# Altium schematic sheet P10_USB TO UART0_IO EXP_ADC.SchDoc
size 420 x 297 mm
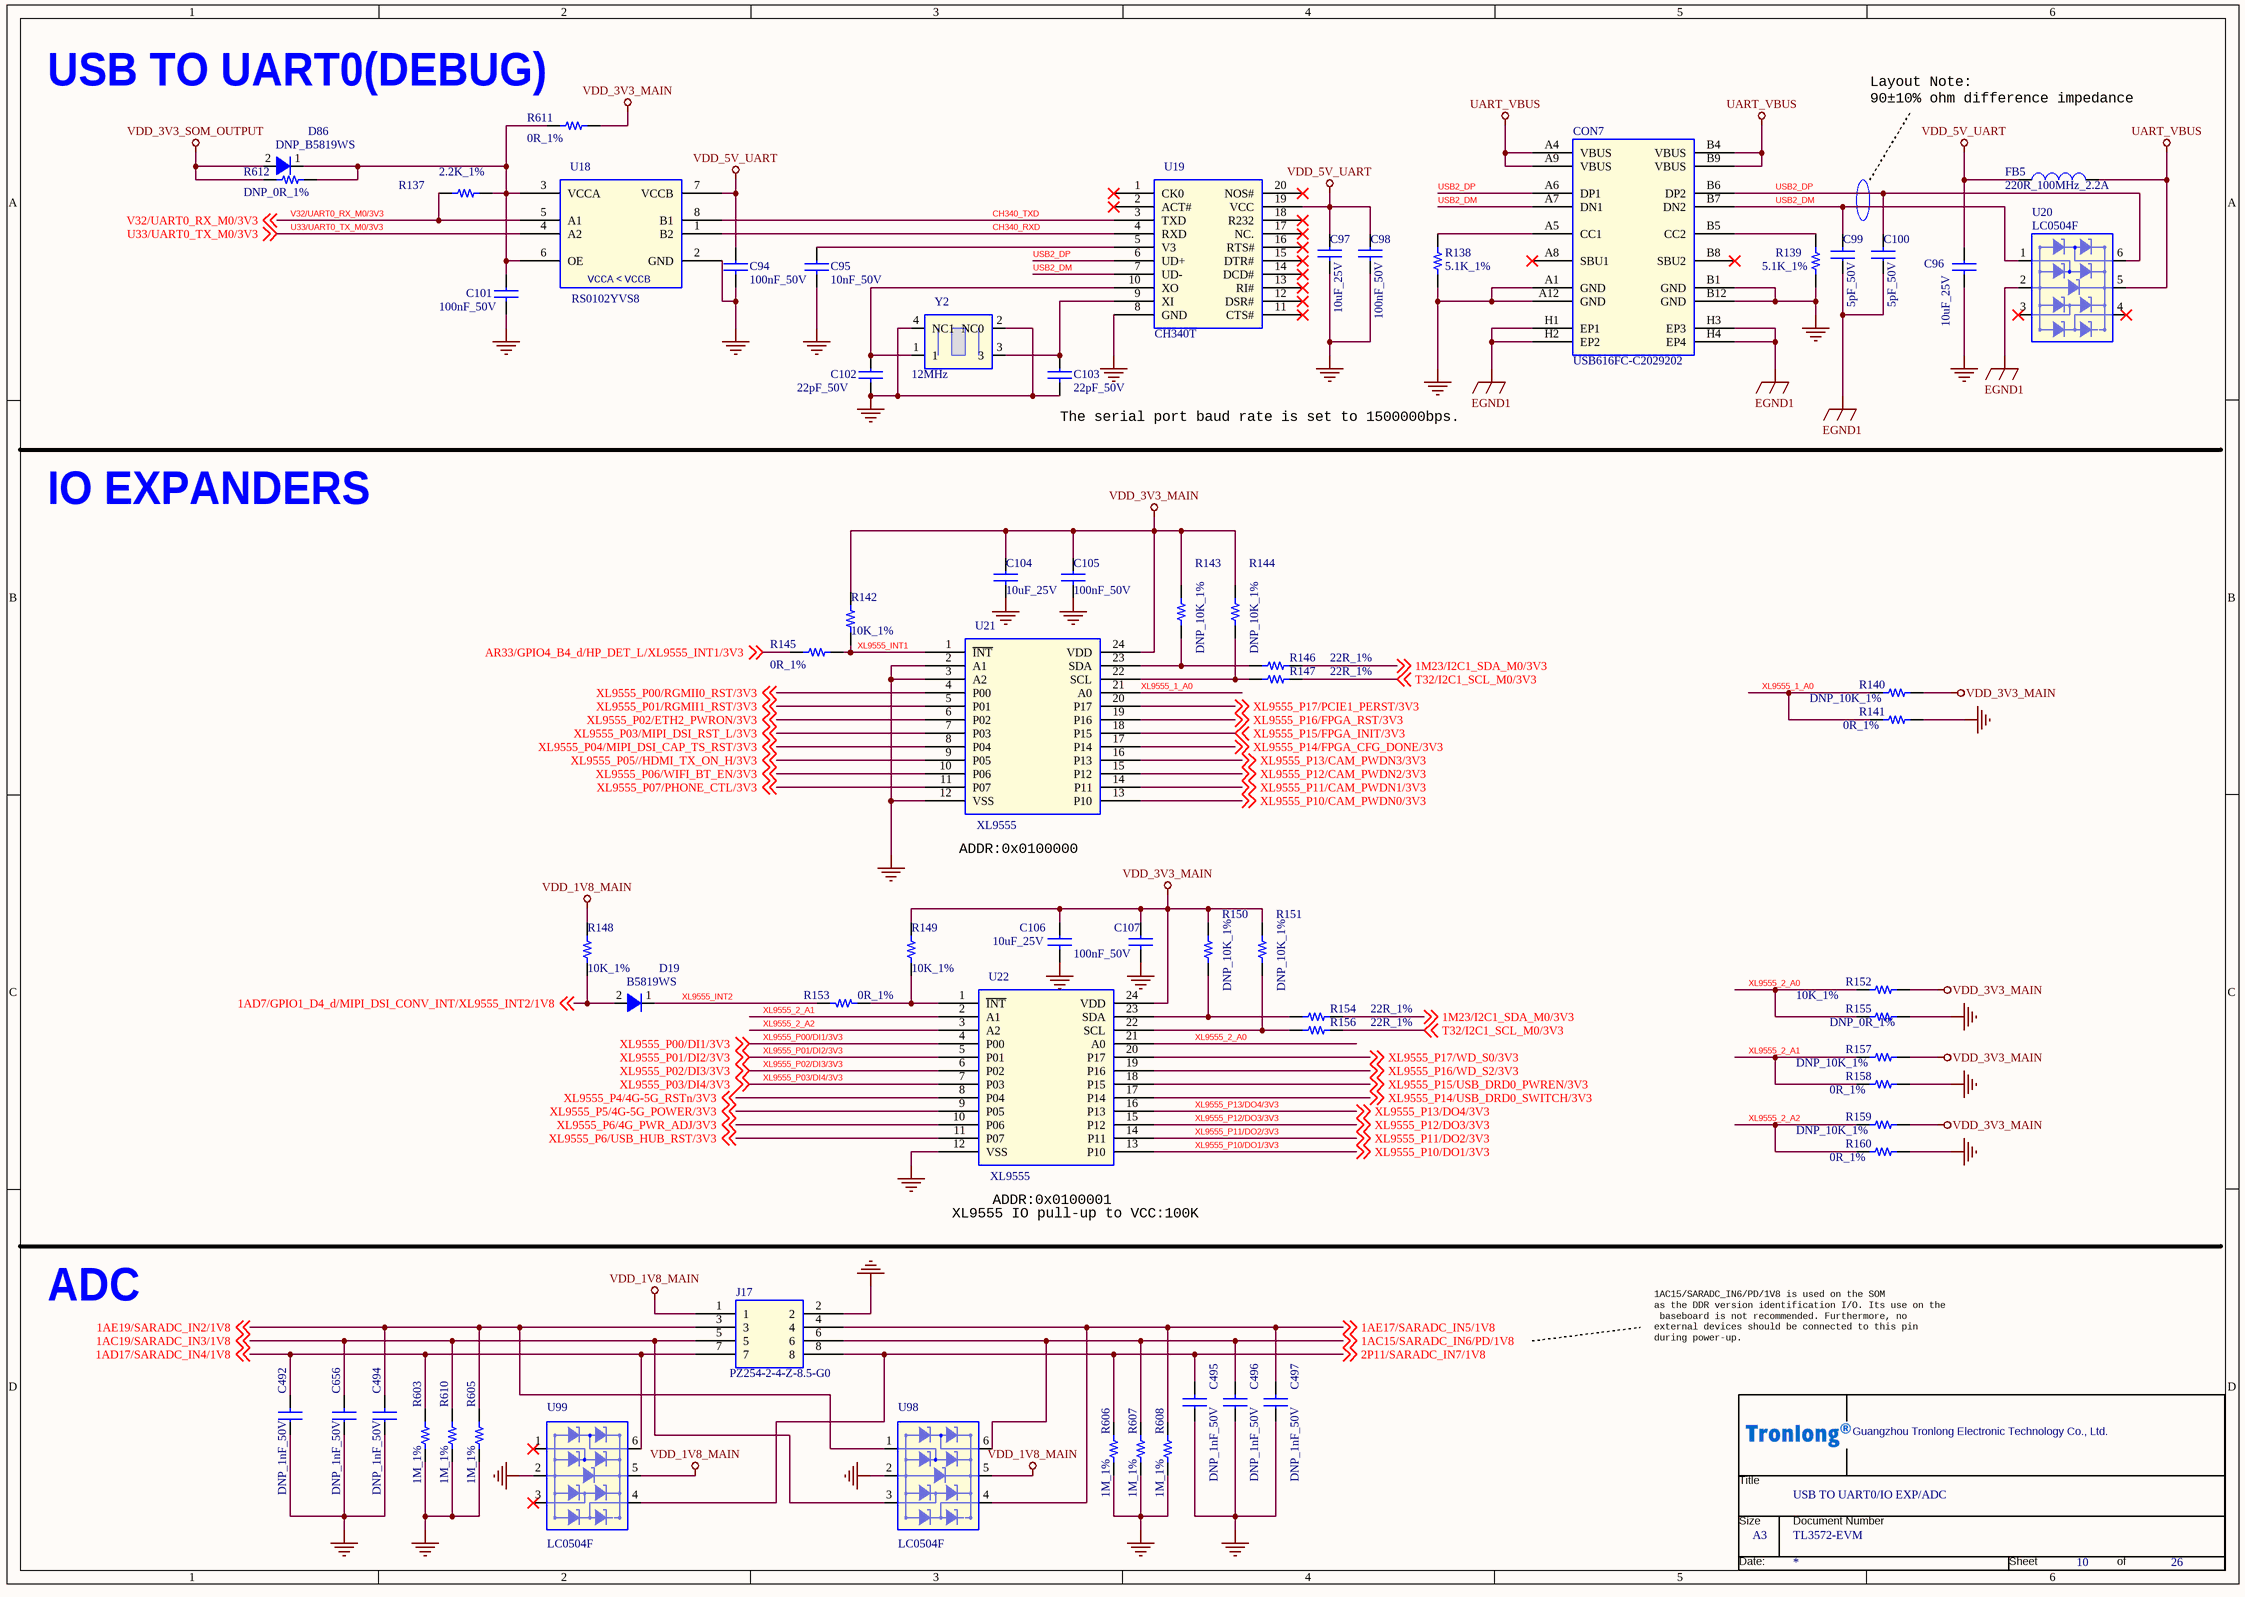
[diagram p0: P10_USB TO UART0_IO EXP_ADC.SchDoc]

## Parts
*  Doc: TL3572-EVM  Title: USB TO UART0/IO EXP/ADC  OrgName: Guangzhou Tronlong Electronic Technology Co., Ltd.  Page Size: A3  Page Number: 10  Page Count: 26  (hidden comment: Tronlong_TITTLE_20211115)  (graphical)
C94  100nF_50V  [C0402]
C95  10nF_50V  [C0402]
C96  10uF_25V  [C0603]
C97  10uF_25V  [C0603]
C98  100nF_50V  [C0402]
C99  5pF_50V  [C0402]
C100  5pF_50V  [C0402]
C101  100nF_50V  [C0402]
C102  22pF_50V  [C0603]
C103  22pF_50V  [C0603]
C104  10uF_25V  [C0603]
C105  100nF_50V  [C0402]
C106  10uF_25V  [C0603]
C107  100nF_50V  [C0402]
C492  DNP_1nF_50V  [C0402]
C494  DNP_1nF_50V  [C0402]
C495  DNP_1nF_50V  [C0402]
C496  DNP_1nF_50V  [C0402]
C497  DNP_1nF_50V  [C0402]
C656  DNP_1nF_50V  [C0402]
CON7  USB616FC-C2029202  [TYPE-C_16P_180_SMD]
D19  B5819WS  [SOD-323]
D86  DNP_B5819WS  [SOD-323]
FB5  220R_100MHz_2.2A  [L0603]
J17  PZ254-2-4-Z-8.5-G0  [CON_2D54_2X4_TH]
R137  2.2K_1%  [R0603]
R138  5.1K_1%  [R0603]
R139  5.1K_1%  [R0603]
R140  DNP_10K_1%  [R0402]
R141  0R_1%  [R0603]
R142  10K_1%  [R0402]
R143  DNP_10K_1%  [R0402]
R144  DNP_10K_1%  [R0402]
R145  0R_1%  [R0402]
R146  22R_1%  [R0402]
R147  22R_1%  [R0402]
R148  10K_1%  [R0402]
R149  10K_1%  [R0402]
R150  DNP_10K_1%  [R0402]
R151  DNP_10K_1%  [R0402]
R152  10K_1%  [R0402]
R153  0R_1%  [R0402]
R154  22R_1%  [R0402]
R155  DNP_0R_1%  [R0402]
R156  22R_1%  [R0402]
R157  DNP_10K_1%  [R0402]
R158  0R_1%  [R0402]
R159  DNP_10K_1%  [R0402]
R160  0R_1%  [R0402]
R603  1M_1%  [R0603]
R605  1M_1%  [R0603]
R606  1M_1%  [R0603]
R607  1M_1%  [R0603]
R608  1M_1%  [R0603]
R610  1M_1%  [R0603]
R611  0R_1%  [R0402]
R612  DNP_0R_1%  [R0402]
U18  RS0102YVS8  [SOP8-20-91]
U19  CH340T  [TSSOP-20]
U20  LC0504F  [SOT363]
U21  XL9555  [TSSOP24]
U22  XL9555  [TSSOP24]
U98  LC0504F  [SOT363]
U99  LC0504F  [SOT363]
Y2  12MHz  [SMD_3225]

## Nets
EGND1: C99.1 C100.1 CON7.H1(EP1) CON7.H2(EP2) CON7.H3(EP3) CON7.H4(EP4) U20.2
GND: C94.2 C95.2 C96.2 C97.2 C98.2 C101.2 C102.2 C103.2 C104.2 C105.2 C106.2 C107.2 C492.1 C494.1 C495.1 C496.1 C497.1 C656.1 CON7.A1(GND) CON7.A12(GND) CON7.B1(GND) CON7.B12(GND) J17.2 R138.2 R139.2 R141.2 R155.2 R158.2 R160.2 R603.2 R605.2 R606.2 R607.2 R608.2 R610.2 U18.2(GND) U19.8(GND) U21.2(A1) U21.3(A2) U21.12(VSS) U22.12(VSS) U98.2 U99.2 Y2.2(NC0) Y2.4(NC1)
UART_VBUS: CON7.A4(VBUS) CON7.A9(VBUS) CON7.B4(VBUS) CON7.B9(VBUS) FB5.2 U20.5
VDD_1V8_MAIN: J17.1 R148.1 U98.5 U99.5
VDD_3V3_MAIN: C104.1 C105.1 C106.1 C107.1 R140.1 R142.1 R143.1 R144.1 R149.1 R150.1 R151.1 R152.1 R157.1 R159.1 R611.2 U21.24(VDD) U22.24(VDD)
VDD_3V3_SOM_OUTPUT: D86.2(Cathode) R612.1
VDD_5V_UART: C94.1 C96.1 C97.1 C98.1 FB5.1 U18.7(VCCB) U19.19(VCC)
1AC15/SARADC_IN6/PD/1V8: C496.2 J17.6 R607.1 U98.6 ; off-sheet 1AC15/SARADC_IN6/PD/1V8
1AC19/SARADC_IN3/1V8: C656.2 J17.5 R610.1 U98.3 ; off-sheet 1AC19/SARADC_IN3/1V8
1AD7/GPIO1_D4_d/MIPI_DSI_CONV_INT/XL9555_INT2/1V8: D19.2(Cathode) R148.2 ; off-sheet 1AD7/GPIO1_D4_d/MIPI_DSI_CONV_INT/XL9555_INT2/1V8
1AD17/SARADC_IN4/1V8: C492.2 J17.7 R603.1 U99.6 ; off-sheet 1AD17/SARADC_IN4/1V8
1AE17/SARADC_IN5/1V8: C497.2 J17.4 R608.1 U98.4 ; off-sheet 1AE17/SARADC_IN5/1V8
1AE19/SARADC_IN2/1V8: C494.2 J17.3 R605.1 U98.1 ; off-sheet 1AE19/SARADC_IN2/1V8
1M23/I2C1_SDA_M0/3V3: R146.1 R154.1 ; off-sheet 1M23/I2C1_SDA_M0/3V3
2P11/SARADC_IN7/1V8: C495.2 J17.8 R606.1 U99.4 ; off-sheet 2P11/SARADC_IN7/1V8
AR33/GPIO4_B4_d/HP_DET_L/XL9555_INT1/3V3: R145.1 ; off-sheet AR33/GPIO4_B4_d/HP_DET_L/XL9555_INT1/3V3
CH340_RXD: U18.1(B2) U19.4(RXD)
CH340_TXD: U18.8(B1) U19.3(TXD)
T32/I2C1_SCL_M0/3V3: R147.1 R156.1 ; off-sheet T32/I2C1_SCL_M0/3V3
U33/UART0_TX_M0/3V3: U18.4(A2) ; off-sheet U33/UART0_TX_M0/3V3
USB2_DM: C99.2 CON7.A7(DN1) CON7.B7(DN2) U19.7(UD-) U20.1
USB2_DP: C100.2 CON7.A6(DP1) CON7.B6(DP2) U19.6(UD+) U20.6
V32/UART0_RX_M0/3V3: R137.1 U18.5(A1) ; off-sheet V32/UART0_RX_M0/3V3
XL9555_1_A0: R140.2 R141.1 U21.21(A0)
XL9555_2_A0: R152.2 R155.1 U22.21(A0)
XL9555_2_A1: R157.2 R158.1 U22.2(A1)
XL9555_2_A2: R159.2 R160.1 U22.3(A2)
XL9555_INT1: R142.2 R145.2 U21.1(~{INT})
XL9555_INT2: D19.1(Anode) R153.1
XL9555_P00/DI1/3V3: U22.4(P00) ; off-sheet XL9555_P00/DI1/3V3
XL9555_P00/RGMII0_RST/3V3: U21.4(P00) ; off-sheet XL9555_P00/RGMII0_RST/3V3
XL9555_P01/DI2/3V3: U22.5(P01) ; off-sheet XL9555_P01/DI2/3V3
XL9555_P01/RGMII1_RST/3V3: U21.5(P01) ; off-sheet XL9555_P01/RGMII1_RST/3V3
XL9555_P02/DI3/3V3: U22.6(P02) ; off-sheet XL9555_P02/DI3/3V3
XL9555_P02/ETH2_PWRON/3V3: U21.6(P02) ; off-sheet XL9555_P02/ETH2_PWRON/3V3
XL9555_P03/DI4/3V3: U22.7(P03) ; off-sheet XL9555_P03/DI4/3V3
XL9555_P03/MIPI_DSI_RST_L/3V3: U21.7(P03) ; off-sheet XL9555_P03/MIPI_DSI_RST_L/3V3
XL9555_P4/4G-5G_RSTn/3V3: U22.8(P04) ; off-sheet XL9555_P4/4G-5G_RSTn/3V3
XL9555_P04/MIPI_DSI_CAP_TS_RST/3V3: U21.8(P04) ; off-sheet XL9555_P04/MIPI_DSI_CAP_TS_RST/3V3
XL9555_P5/4G-5G_POWER/3V3: U22.9(P05) ; off-sheet XL9555_P5/4G-5G_POWER/3V3
XL9555_P05//HDMI_TX_ON_H/3V3: U21.9(P05) ; off-sheet XL9555_P05//HDMI_TX_ON_H/3V3
XL9555_P6/4G_PWR_ADJ/3V3: U22.10(P06) ; off-sheet XL9555_P6/4G_PWR_ADJ/3V3
XL9555_P6/USB_HUB_RST/3V3: U22.11(P07) ; off-sheet XL9555_P6/USB_HUB_RST/3V3
XL9555_P06/WIFI_BT_EN/3V3: U21.10(P06) ; off-sheet XL9555_P06/WIFI_BT_EN/3V3
XL9555_P07/PHONE_CTL/3V3: U21.11(P07) ; off-sheet XL9555_P07/PHONE_CTL/3V3
XL9555_P10/CAM_PWDN0/3V3: U21.13(P10) ; off-sheet XL9555_P10/CAM_PWDN0/3V3
XL9555_P10/DO1/3V3: U22.13(P10) ; off-sheet XL9555_P10/DO1/3V3
XL9555_P11/CAM_PWDN1/3V3: U21.14(P11) ; off-sheet XL9555_P11/CAM_PWDN1/3V3
XL9555_P11/DO2/3V3: U22.14(P11) ; off-sheet XL9555_P11/DO2/3V3
XL9555_P12/CAM_PWDN2/3V3: U21.15(P12) ; off-sheet XL9555_P12/CAM_PWDN2/3V3
XL9555_P12/DO3/3V3: U22.15(P12) ; off-sheet XL9555_P12/DO3/3V3
XL9555_P13/CAM_PWDN3/3V3: U21.16(P13) ; off-sheet XL9555_P13/CAM_PWDN3/3V3
XL9555_P13/DO4/3V3: U22.16(P13) ; off-sheet XL9555_P13/DO4/3V3
XL9555_P14/FPGA_CFG_DONE/3V3: U21.17(P14) ; off-sheet XL9555_P14/FPGA_CFG_DONE/3V3
XL9555_P14/USB_DRD0_SWITCH/3V3: U22.17(P14) ; off-sheet XL9555_P14/USB_DRD0_SWITCH/3V3
XL9555_P15/FPGA_INIT/3V3: U21.18(P15) ; off-sheet XL9555_P15/FPGA_INIT/3V3
XL9555_P15/USB_DRD0_PWREN/3V3: U22.18(P15) ; off-sheet XL9555_P15/USB_DRD0_PWREN/3V3
XL9555_P16/FPGA_RST/3V3: U21.19(P16) ; off-sheet XL9555_P16/FPGA_RST/3V3
XL9555_P16/WD_S2/3V3: U22.19(P16) ; off-sheet XL9555_P16/WD_S2/3V3
XL9555_P17/PCIE1_PERST/3V3: U21.20(P17) ; off-sheet XL9555_P17/PCIE1_PERST/3V3
XL9555_P17/WD_S0/3V3: U22.20(P17) ; off-sheet XL9555_P17/WD_S0/3V3
NetC95_1: C95.1 U19.5(V3)
NetC101_1: C101.1 D86.1(Anode) R137.2 R611.1 R612.2 U18.3(VCCA) U18.6(OE)
NetC102_1: C102.1 U19.10(XO) Y2.1
NetC103_1: C103.1 U19.9(XI) Y2.3
NetCON7_A5: CON7.A5(CC1) R138.1
NetCON7_B5: CON7.B5(CC2) R139.1
NetR143_2: R143.2 R146.2 U21.23(SDA)
NetR144_2: R144.2 R147.2 U21.22(SCL)
NetR149_2: R149.2 R153.2 U22.1(~{INT})
NetR150_2: R150.2 R154.2 U22.23(SDA)
NetR151_2: R151.2 R156.2 U22.22(SCL)

Not connected (* = marked no-connect by the designer): CON7 A8(SBU1)* B8(SBU2)*; U19 1(CK0)* 2(ACT#)* 11(CTS#)* 12(DSR#)* 13(RI#)* 14(DCD#)* 15(DTR#)* 16(RTS#)* 17(NC.)* 18(R232)* 20(NOS#)*; U20 3* 4*; U99 1* 3*

## Notes on the sheet
- USB TO UART0(DEBUG)
- Layout Note:
  90±10% ohm difference impedance
- (near C103) The serial port baud rate is set to 1500000bps.
- IO EXPANDERS
- (near U21) ADDR:0x0100000
- (near U22) ADDR:0x0100001
- XL9555 IO pull-up to VCC:100K
- ADC
- (near *) 1AC15/SARADC_IN6/PD/1V8 is used on the SOM
  as the DDR version identification I/O. Its use on the
  baseboard is not recommended. Furthermore, no
  external devices should be connected to this pin
  during power-up.
- (in symbol Tronlong_TITTLE_20211115) Title; Size; Document Number; Date:; Sheet; of
- (in symbol TXS0102DCUR_0) VCCA＜VCCB

## Library data of the parts
* = Tronlong_TITTLE_20211115: RevCode: A?; Page Create Date: March  8, 1995; Page Modify Date: *
C94 = CAP NP_Dup3: 贴片陶瓷电容,100nF,10%,50V,X7R; Manufacturer PartNumber: 0402B104K500NT; Manufacturer: 广东风华高新科技股份有限公司（FH）; Manufacturer Character: 中国大陆; Eco-Label: ROHS; Operation Temperature（℃）: -55~+125(Ta); ERP Number: 005.0001.0001.00681; As-Welded: /; PCB Footprint: C0402; Temperature: -55~155℃; Part Status: 试用
C95 = CAP NP_Dup3: 贴片陶瓷电容,10nF,10%,50V,X7R; Manufacturer Character: 中国大陆; Manufacturer PartNumber: 0402B103K500NT; Manufacturer: 广东风华高新科技股份有限公司（FH）; Eco-Label: ROHS; ERP Number: 005.0001.0001.00522; As-Welded: /; Operation Temperature（℃）: -55~+125(Ta); PCB Footprint: C0402; Part Status: 优选; Temperature: -55~155℃
C96 = CAP NP_Dup3: 贴片陶瓷电容,10uF,20%,25V,X5R; Manufacturer Character: 中国大陆; Manufacturer PartNumber: 0603X106M250NT; Manufacturer: 广东风华高新科技股份有限公司（FH）; Eco-Label: ROHS; ERP Number: 005.0001.0001.00527; As-Welded: /; room: usbuart; Operation Temperature（℃）: -55~+85(Ta); PCB Footprint: C0603; Part Status: 优选; Temperature: -55~155℃
C97 = CAP NP_Dup3: 贴片陶瓷电容,10uF,20%,25V,X5R; Manufacturer: 广东风华高新科技股份有限公司（FH）; Manufacturer PartNumber: 0603X106M250NT; Manufacturer Character: 中国大陆; Operation Temperature（℃）: -55~+85(Ta); As-Welded: /; ERP Number: 005.0001.0001.00527; Eco-Label: ROHS; PCB Footprint: C0603; Temperature: -55~155℃; Part Status: 优选
C98 C101 = CAP NP_Dup3: 贴片陶瓷电容,100nF,10%,50V,X7R; Manufacturer Character: 中国大陆; Manufacturer PartNumber: 0402B104K500NT; Manufacturer: 广东风华高新科技股份有限公司（FH）; As-Welded: /; ERP Number: 005.0001.0001.00681; Operation Temperature（℃）: -55~+125(Ta); Eco-Label: ROHS; PCB Footprint: C0402; Temperature: -55~155℃; Part Status: 试用
C99 = CAP NP_1: CC0402BRNPO9BN5R0; Manufacturer: 广州创龙; Manufacturer PN: GRM033R61E102KA01; Manufacturer PartNumber: 5pF,2%,C0402,50V,（NPO）; Eco-Label: ROHS; ERP Number: 005.0001.0022.00228; RK PN: 902003109; Priority: A; Tolerance: ±10%; Operation Temperature（℃）: -40~+85(Ta); As-Welded: /; Part Type: 一般用片状陶瓷电容; Created by: JJJ; Manufacturer Character: -; Part Status: -
C100 = CAP NP_1: CC0402BRNPO9BN5R0; Manufacturer PartNumber: 5pF,2%,C0402,50V,（NPO）; Manufacturer PN: GRM033R61E102KA01; Manufacturer: 广州创龙; Eco-Label: ROHS; As-Welded: /; Operation Temperature（℃）: -40~+85(Ta); Tolerance: ±10%; Priority: A; RK PN: 902003109; ERP Number: 005.0001.0022.00228; Manufacturer Character: -; Created by: JJJ; Part Type: 一般用片状陶瓷电容; Part Status: -
C102 C103 = CAP NP_Dup3: 贴片陶瓷电容,22pF,5%,50V,COG; Manufacturer: 广东风华高新科技股份有限公司（FH）; Manufacturer PartNumber: 0603CG220J500NT; Manufacturer Character: 中国大陆; Eco-Label: EXEMPTION; ERP Number: 005.0001.0001.00542; Operation Temperature（℃）: -55~+125(Ta); As-Welded: /; PCB Footprint: C0603; Part Status: 优选; Temperature: -55~155℃
C104 = CAP NP_Dup3: 贴片陶瓷电容,4.7uF,10%,25V,X5R; Manufacturer: 广东风华高新科技股份有限公司（FH）; Manufacturer PartNumber: 0603X475K250NT; Manufacturer Character: 中国大陆; Operation Temperature（℃）: -55~+85(Ta); As-Welded: /; ERP Number: 005.0001.0001.00527; Eco-Label: ROHS; PCB Footprint: C0603; Part Status: 优选
C105 = CAP NP_Dup3: 贴片陶瓷电容,100nF,10%,50V,X7R; Manufacturer: 广东风华高新科技股份有限公司（FH）; Manufacturer PartNumber: 0402B104K500NT; Manufacturer Character: 中国大陆; Operation Temperature（℃）: -55~+125(Ta); As-Welded: /; ERP Number: 005.0001.0001.00681; Eco-Label: ROHS; PCB Footprint: C0402; Part Status: 试用
C106 = CAP NP_Dup2: 贴片陶瓷电容10uF,20%,25V,X5R; Manufacturer Character: 中国大陆; Manufacturer: 广东风华高新科技股份有限公司（FH）; Manufacturer PartNumber: 0603X106M250NT; ERP Number: 005.0001.0001.00527; As-Welded: /; Operation Temperature（℃）: -55~+85(Ta); room: 6; Eco-Label: ROHS; PCB Footprint: C0603; Part Status: 优选; Temperature: -55~125℃
C107 = CAP NP_Dup2: 贴片陶瓷电容,100nF,10%,50V,X7R; Manufacturer PartNumber: 0402B104K500NT; Manufacturer: 广东风华高新科技股份有限公司（FH）; Manufacturer Character: 中国大陆; ERP Number: 005.0001.0001.00681; Operation Temperature（℃）: -55~+125(Ta); As-Welded: /; Eco-Label: ROHS; PCB Footprint: C0402; Part Status: 试用; Temperature: -55~125℃
C492 C494-C497 = CAP NP_Dup3: 贴片陶瓷电容,1nF,10%,50V,X7R; Manufacturer: 广东风华高新科技股份有限公司（FH）; Manufacturer PartNumber: 0402B102K500NT; Manufacturer Character: 中国大陆; As-Welded: DNP; Purchase Information: 13510796878 伊美尔电子; Standard PCB Footprint: 603; PCB Footprint Status: Checked; Operation Temperature（℃）: -55~+125(Ta); ERP Number: 005.0001.0001.00523; Eco-Label: ROHS; PCB Footprint: C0402; Part Status: On Hand; Price: 0.0072; Part Type: CAPACITOR; Part Number: 117-00-3036
C656 = CAP NP_Dup3: 贴片陶瓷电容,1nF,10%,50V,X7R; Manufacturer Character: 中国大陆; Manufacturer PartNumber: 0402B102K500NT; Manufacturer: 广东风华高新科技股份有限公司（FH）; Eco-Label: ROHS; ERP Number: 005.0001.0001.00523; Operation Temperature（℃）: -55~+125(Ta); PCB Footprint Status: Checked; Standard PCB Footprint: 603; Purchase Information: 13510796878 伊美尔电子; As-Welded: DNP; PCB Footprint: C0402; Part Number: 117-00-3036; Part Type: CAPACITOR; Price: 0.0072; Part Status: On Hand
CON7 = usb 3_0.0 type-c female: Type-C座,16P,0.8mm,母座,侧贴; Manufacturer Character: 中国大陆; Manufacturer: 深圳市爱特姆科技有限公司（ATOM）; Eco-Label: ROHS; ERP Number: 005.0001.0003.00751; As-Welded: /; room: 10; Operation Temperature（℃）: -40~85(Ta); PCB Footprint: TYPE-C_16P_180_SMD; Temperature: -40~85℃; Manufacturer PartNumber: USB616FC-C2029202; Part Status: 试用
D19 = Diode200mA250V_2: 肖特基二极管,VR=40V,IF=1A,VF=0.6V@1A; Mfr: On Semiconductor; MfrNum: MMSD103T1G; TIIntPartnumber: 1E0013; Manufacturer: 江苏长晶科技股份有限公司（JSCJ）; Manufacturer Character: 中国大陆; Descriptive_Text: Diode 200mA 250V 1.25V Forward Drop; Vendor: Digikey; Cost100: 0.23; Cost10K: 0.07; PCB Footprint: smd123; Eco-Label: ROHS; ERP Number: 005.0001.0010.00093; Operation Temperature（℃）: -55~+125(Tj); As-Welded: /; PartName: Diode200mA250V; DescriptiveText: Diode 200mA 250V 1.25V Forward Drop; Part Status: 优选; Manufacturer PartNumber: B5819WS; Temperature: -40~125℃
D86 = Diode200mA250V_2: 肖特基二极管,VR=40V,IF=1A,VF=0.6V@1A; Mfr: On Semiconductor; MfrNum: MMSD103T1G; TIIntPartnumber: 1E0013; Manufacturer Character: 中国大陆; Manufacturer: 江苏长晶科技股份有限公司（JSCJ）; Descriptive_Text: Diode 200mA 250V 1.25V Forward Drop; Vendor: Digikey; Cost100: 0.23; Cost10K: 0.07; PCB Footprint: smd123; As-Welded: DNP; Operation Temperature（℃）: -55~+125(Tj); ERP Number: 005.0001.0010.00093; Eco-Label: ROHS; PartName: Diode200mA250V; DescriptiveText: Diode 200mA 250V 1.25V Forward Drop; Temperature: -40~125℃; Manufacturer PartNumber: B5819WS; Part Status: 优选
FB5 = FERRITE BEAD_0: 磁珠,50mΩ,2.2A,220R@100MHz; Manufacturer Character: 中国大陆; Manufacturer: 深圳顺络电子股份有限公司（Sunlord）; Manufacturer PartNumber: UPZ1608U221-2R2TF; Eco-Label: ROHS; Operation Temperature（℃）: -55~+125(Ta); room: usbuart; ERP Number: 005.0001.0007.00015; As-Welded: /; PCB Footprint: L0603; Part Status: 限选; Temperature: -55~125℃
J17 = PZ254-2-04-Z-8.5-G0: 插件双排排针,2x4P,2.54mm,针长L=11.5mm,180度; Manufacturer: 深圳市华灿天禄电子有限公司（HCTL); Manufacturer Character: 中国大陆; ERP Number: 005.0001.0003.00627; Eco-Label: ROHS; As-Welded: /; Operation Temperature（℃）: -55~+105(Ta); PCB Footprint: CON_2D54_2X4_TH; Manufacturer PartNumber: PZ254-2-4-Z-8.5-G0; Part Status: 试用
R137 = Resistor_Dup4: 贴片电阻,2.2K,±1%,1/10W; Manufacturer Character: 中国大陆; Manufacturer PartNumber: RS-03K2201FT; Manufacturer: 广东风华高新科技股份有限公司（FH）; CLASS: DISCRETE; Eco-Label: ROHS; ERP Number: 005.0001.0002.00972; As-Welded: /; room: JTAG; Operation Temperature（℃）: -55~+155(Ta); PCB Footprint: R0603; Part Status: 优选; Temperature: -55~155℃
R138 = Resistor_Dup4: RC0603FR-075K1L,0603WAF5101T5E; Manufacturer PartNumber: 5.1K,±1%,R0603,≥1/10W; Manufacturer: 广州创龙; CLASS: DISCRETE; Eco-Label: ROHS; ERP Number: 005.0001.0023.00471; As-Welded: /; room: JTAG; Operation Temperature（℃）: -40~+85(Ta); PCB Footprint: R0603; Part Status: -; Manufacturer Character: -; Temperature: -55~155℃
R139 = Resistor_Dup4: RC0603FR-075K1L,0603WAF5101T5E; Manufacturer: 广州创龙; Manufacturer PartNumber: 5.1K,±1%,R0603,≥1/10W; CLASS: DISCRETE; room: JTAG; Operation Temperature（℃）: -40~+85(Ta); As-Welded: /; ERP Number: 005.0001.0023.00471; Eco-Label: ROHS; PCB Footprint: R0603; Manufacturer Character: -; Temperature: -55~155℃; Part Status: -
R140 = Resistor_Dup2: 贴片电阻,10K,±1%,1/16W; Manufacturer PartNumber: RC-02K1002FT; Manufacturer: 广东风华高新科技股份有限公司（FH）; Manufacturer Character: 中国大陆; CLASS: DISCRETE; Eco-Label: ROHS; ERP Number: 005.0001.0002.01326; As-Welded: DNP; Operation Temperature（℃）: -55~+125(Ta); PCB Footprint: R0402; Temperature: -55~155℃; Part Status: 优选
R141 = Resistor_Dup2: 贴片电阻,0R,±1%,1/10W; Manufacturer Character: 中国大陆; Manufacturer: 广东风华高新科技股份有限公司（FH）; Manufacturer PartNumber: RS-03000FT; CLASS: DISCRETE; Eco-Label: ROHS; ERP Number: 005.0001.0002.00956; Operation Temperature（℃）: -55~+155(Ta); As-Welded: /; PCB Footprint: R0603; Temperature: -55~155℃; Part Status: 优选
R142 = Resistor_Dup2: 贴片电阻,10K,±1%,1/16W; Manufacturer PartNumber: RC-02K1002FT; Manufacturer: 广东风华高新科技股份有限公司（FH）; Manufacturer Character: 中国大陆; CLASS: DISCRETE; Eco-Label: ROHS; ERP Number: 005.0001.0002.01326; As-Welded: /; Operation Temperature（℃）: -55~+125(Ta); PCB Footprint: R0402; Part Status: 优选; Temperature: -55~155℃
R143 R144 = Resistor_Dup2: 贴片电阻,10K,±1%,1/16W; Manufacturer Character: 中国大陆; Manufacturer: 广东风华高新科技股份有限公司（FH）; Manufacturer PartNumber: RC-02K1002FT; CLASS: DISCRETE; Operation Temperature（℃）: -55~+125(Ta); As-Welded: DNP; ERP Number: 005.0001.0002.01326; Eco-Label: ROHS; PCB Footprint: R0402; Part Status: 优选; Temperature: -55~155℃
R145 = Resistor_Dup2: 贴片电阻,0R,±1%,1/16W; Manufacturer Character: 中国大陆; Manufacturer: 广东风华高新科技股份有限公司（FH）; Manufacturer PartNumber: RC-02000FT; CLASS: DISCRETE; Eco-Label: ROHS; ERP Number: 005.0001.0002.00938; Operation Temperature（℃）: -55~+155(Ta); As-Welded: /; PCB Footprint: R0402; Temperature: -55~155℃; Part Status: 优选
R146 = Resistor_Dup2: 贴片电阻,22R,±1%,1/16W; Manufacturer PartNumber: RC-02K22R0FT; Manufacturer: 广东风华高新科技股份有限公司（FH）; Manufacturer Character: 中国大陆; CLASS: DISCRETE; Eco-Label: ROHS; ERP Number: 005.0001.0002.01316; Operation Temperature（℃）: -55~+125(Ta); As-Welded: /; PCB Footprint: R0402; Part Status: 试用; Temperature: -55~155℃
R147 = Resistor_Dup2: 贴片电阻,22R,±1%,1/16W; Manufacturer PartNumber: RC-02K22R0FT; Manufacturer: 广东风华高新科技股份有限公司（FH）; Manufacturer Character: 中国大陆; CLASS: DISCRETE; Eco-Label: ROHS; ERP Number: 005.0001.0002.01316; As-Welded: /; Operation Temperature（℃）: -55~+125(Ta); PCB Footprint: R0402; Part Status: 试用; Temperature: -55~155℃
R148 R149 R152 = Resistor: 贴片电阻,10K,±1%,1/16W; Manufacturer PartNumber: RC-02K1002FT; Manufacturer: 广东风华高新科技股份有限公司（FH）; Manufacturer Character: 中国大陆; CLASS: DISCRETE; ERP Number: 005.0001.0002.01326; As-Welded: /; Operation Temperature（℃）: -55~+125(Ta); Eco-Label: ROHS; PCB Footprint: R0402; Temperature: -55~155℃; Part Status: 优选
R150 R157 R159 = Resistor: 贴片电阻,10K,±1%,1/16W; Manufacturer PartNumber: RC-02K1002FT; Manufacturer: 广东风华高新科技股份有限公司（FH）; Manufacturer Character: 中国大陆; CLASS: DISCRETE; ERP Number: 005.0001.0002.01326; As-Welded: DNP; Operation Temperature（℃）: -55~+125(Ta); Eco-Label: ROHS; PCB Footprint: R0402; Part Status: 优选; Temperature: -55~155℃
R151 = Resistor: 贴片电阻,10K,±1%,1/16W; Manufacturer Character: 中国大陆; Manufacturer: 广东风华高新科技股份有限公司（FH）; Manufacturer PartNumber: RC-02K1002FT; CLASS: DISCRETE; ERP Number: 005.0001.0002.01326; Operation Temperature（℃）: -55~+125(Ta); As-Welded: DNP; Eco-Label: ROHS; PCB Footprint: R0402; Part Status: 优选; Temperature: -55~155℃
R153 = Resistor: 贴片电阻,0R,±1%,1/16W; Manufacturer Character: 中国大陆; Manufacturer: 广东风华高新科技股份有限公司（FH）; Manufacturer PartNumber: RC-02000FT; CLASS: DISCRETE; Eco-Label: ROHS; ERP Number: 005.0001.0002.00938; Operation Temperature（℃）: -55~+155(Ta); As-Welded: /; PCB Footprint: R0402; Part Status: 优选
R154 = Resistor: 贴片电阻,22R,±1%,1/16W; Manufacturer Character: 中国大陆; Manufacturer: 广东风华高新科技股份有限公司（FH）; Manufacturer PartNumber: RC-02K22R0FT; CLASS: DISCRETE; ERP Number: 005.0001.0002.01316; As-Welded: /; Operation Temperature（℃）: -55~+125(Ta); Eco-Label: ROHS; PCB Footprint: R0402; Part Status: 试用; Temperature: -55~155℃
R155 = Resistor: 贴片电阻,0R,±1%,1/16W; Manufacturer PartNumber: RC-02000FT; Manufacturer: 广东风华高新科技股份有限公司（FH）; Manufacturer Character: 中国大陆; CLASS: DISCRETE; Eco-Label: ROHS; As-Welded: DNP; Operation Temperature（℃）: -55~+155(Ta); ERP Number: 005.0001.0002.00938; PCB Footprint: R0402; Part Status: 优选; Temperature: -55~155℃
R156 = Resistor: 贴片电阻,22R,±1%,1/16W; Manufacturer Character: 中国大陆; Manufacturer: 广东风华高新科技股份有限公司（FH）; Manufacturer PartNumber: RC-02K22R0FT; CLASS: DISCRETE; ERP Number: 005.0001.0002.01316; Operation Temperature（℃）: -55~+125(Ta); As-Welded: /; Eco-Label: ROHS; PCB Footprint: R0402; Part Status: 试用; Temperature: -55~155℃
R158 R160 = Resistor: 贴片电阻,0R,±1%,1/16W; Manufacturer PartNumber: RC-02000FT; Manufacturer: 广东风华高新科技股份有限公司（FH）; Manufacturer Character: 中国大陆; CLASS: DISCRETE; Eco-Label: ROHS; ERP Number: 005.0001.0002.00938; As-Welded: /; Operation Temperature（℃）: -55~+155(Ta); PCB Footprint: R0402; Temperature: -55~155℃; Part Status: 优选
R603 R605 R610 = Resistor_Dup3: 贴片电阻,1M,±1%,1/10W; Manufacturer Character: 中国大陆; Manufacturer PartNumber: RS-03K1004FT; Manufacturer: 广东风华高新科技股份有限公司（FH）; CLASS: DISCRETE; Eco-Label: ROHS; ERP Number: 005.0001.0002.01191; As-Welded: /; room: USB HUB; Operation Temperature（℃）: -55~+155(Ta); PCB Footprint: R0603; Part Status: 试用
R606 R608 = Resistor_Dup3: 贴片电阻,1M,±1%,1/10W; Manufacturer: 广东风华高新科技股份有限公司（FH）; Manufacturer PartNumber: RS-03K1004FT; Manufacturer Character: 中国大陆; CLASS: DISCRETE; Eco-Label: ROHS; ERP Number: 005.0001.0002.01191; Operation Temperature（℃）: -55~+155(Ta); room: USB HUB; As-Welded: /; PCB Footprint: R0603; Part Status: 试用
R607 = Resistor_Dup3: 贴片电阻,1M,±1%,1/10W; Manufacturer Character: 中国大陆; Manufacturer PartNumber: RS-03K1004FT; Manufacturer: 广东风华高新科技股份有限公司（FH）; CLASS: DISCRETE; As-Welded: /; room: USB HUB; Operation Temperature（℃）: -55~+155(Ta); ERP Number: 005.0001.0002.01191; Eco-Label: ROHS; PCB Footprint: R0603; Part Status: 试用
R611 = Resistor_Dup2: 贴片电阻,0R,±1%,1/16W; Manufacturer PartNumber: RC-02000FT; Manufacturer: 广东风华高新科技股份有限公司（FH）; Manufacturer Character: 中国大陆; CLASS: DISCRETE; As-Welded: /; Operation Temperature（℃）: -55~+155(Ta); ERP Number: 005.0001.0002.00938; Eco-Label: ROHS; PCB Footprint: R0402; Part Status: 优选; Temperature: -55~155℃
R612 = Resistor_Dup2: 贴片电阻,0R,±1%,1/16W; Manufacturer PartNumber: RC-02000FT; Manufacturer: 广东风华高新科技股份有限公司（FH）; Manufacturer Character: 中国大陆; CLASS: DISCRETE; As-Welded: DNP; Operation Temperature（℃）: -55~+155(Ta); ERP Number: 005.0001.0002.00938; Eco-Label: ROHS; PCB Footprint: R0402; Part Status: 优选; Temperature: -55~155℃
U18 = TXS0102DCUR_0: 2位双向电平转换器; Manufacturer: 江苏润石科技有限公司（RUNIC）; Manufacturer Character: 中国大陆; Eco-Label: ROHS; ERP Number: 005.0001.0004.00890; As-Welded: /; Operation Temperature（℃）: -40~+85(Ta); PCB Footprint: SOP8-20-91; Part Status: 试用; Temperature: -40~85℃; Manufacturer PartNumber: RS0102YVS8
U19 = CH340T: USB转UART芯片; Manufacturer Character: 中国大陆; Manufacturer: 南京沁恒微电子股份有限公司（WCH）; Eco-Label: ROHS; ERP Number: 005.0001.0004.00479; As-Welded: /; Operation Temperature（℃）: -40~+85(Ta); PCB Footprint: TSSOP-20; Part Status: 优选; Temperature: -40~85℃; Manufacturer PartNumber: CH340T
U20 = PRTR5V0U4Y: ESD二极管,VRWM=5V,VBR=6V,四组,单向,8KV,15KV; Manufacturer Character: 中国大陆; Manufacturer: 上海雷卯电子科技有限公司（Leiditech）; room: DRDUSB; Operation Temperature（℃）: -55~+125(Tj); As-Welded: /; ERP Number: 005.0001.0017.00061; Eco-Label: ROHS; PCB Footprint: SOT363; Temperature: -55~125℃; Manufacturer PartNumber: LC0504F; Part Status: 优选
U21 = XL9555_0: 拓展IO芯片; Manufacturer Character: 中国大陆; Manufacturer: 信路达信息技术（厦门）有限（xinluda）; Eco-Label: ROHS; ERP Number: 005.0004.0001.00013; As-Welded: /; Operation Temperature（℃）: -40~+85(Ta); PCB Footprint: TSSOP24; Part Status: 试用; Temperature: -40~85℃; Manufacturer PartNumber: XL9555
U22 = XL9555_0: 拓展IO芯片; Manufacturer: 信路达信息技术（厦门）有限公司（xinluda）; Manufacturer Character: 中国大陆; ERP Number: 005.0004.0001.00013; Operation Temperature（℃）: -40~+85(Ta); As-Welded: /; Eco-Label: ROHS; PCB Footprint: TSSOP24; Part Status: 试用; Manufacturer PartNumber: XL9555; Temperature: -40~85℃
U98 = PRTR5V0U4Y: ESD二极管,VRWM=5V,VBR=6V,四组,单向,8KV,15KV; Manufacturer: 上海雷卯电子科技有限公司（Leiditech）; Manufacturer Character: 中国大陆; Eco-Label: ROHS; ERP Number: 005.0001.0017.00061; As-Welded: /; Operation Temperature（℃）: -55~+125(Tj); room: 8; PCB Footprint: SOT363; Part Status: 优选; Temperature: -55~125℃; Manufacturer PartNumber: LC0504F
U99 = PRTR5V0U4Y: ESD二极管,VRWM=5V,VBR=6V,四组,单向,8KV,15KV; Manufacturer Character: 中国大陆; Manufacturer: 上海雷卯电子科技有限公司（Leiditech）; room: 8; Operation Temperature（℃）: -55~+125(Tj); As-Welded: /; ERP Number: 005.0001.0017.00061; Eco-Label: ROHS; PCB Footprint: SOT363; Part Status: 优选; Manufacturer PartNumber: LC0504F; Temperature: -55~125℃
Y2 = CRYSTAL: 四脚无源晶振,12MHz,±10ppm,12pF,100Ω,±30ppm; Manufacturer Character: 中国大陆; Manufacturer: 深圳市星通时频电子有限公司（SCTF）; Manufacturer PartNumber: S3B12.000F1210F30; Eco-Label: ROHS; ERP Number: 005.0001.0005.00120; As-Welded: /; Operation Temperature（℃）: -40~+85(Ta); PCB Footprint: SMD_3225; Part Status: 试用; Temperature: -40~85℃